# EasyEDA Pro project ProDocument_HMC832_2024-11-26.epro

# Schematic Schematic8

## Sheets
1 P1: Create Date: 2024-09-26; Page Name: P1; Project Name: STI_Project; Schematic Name: Schematic8; Update Date: 2024-09-26; Company: 嘉立创EDA; Page Size: A4; Version: V1.0
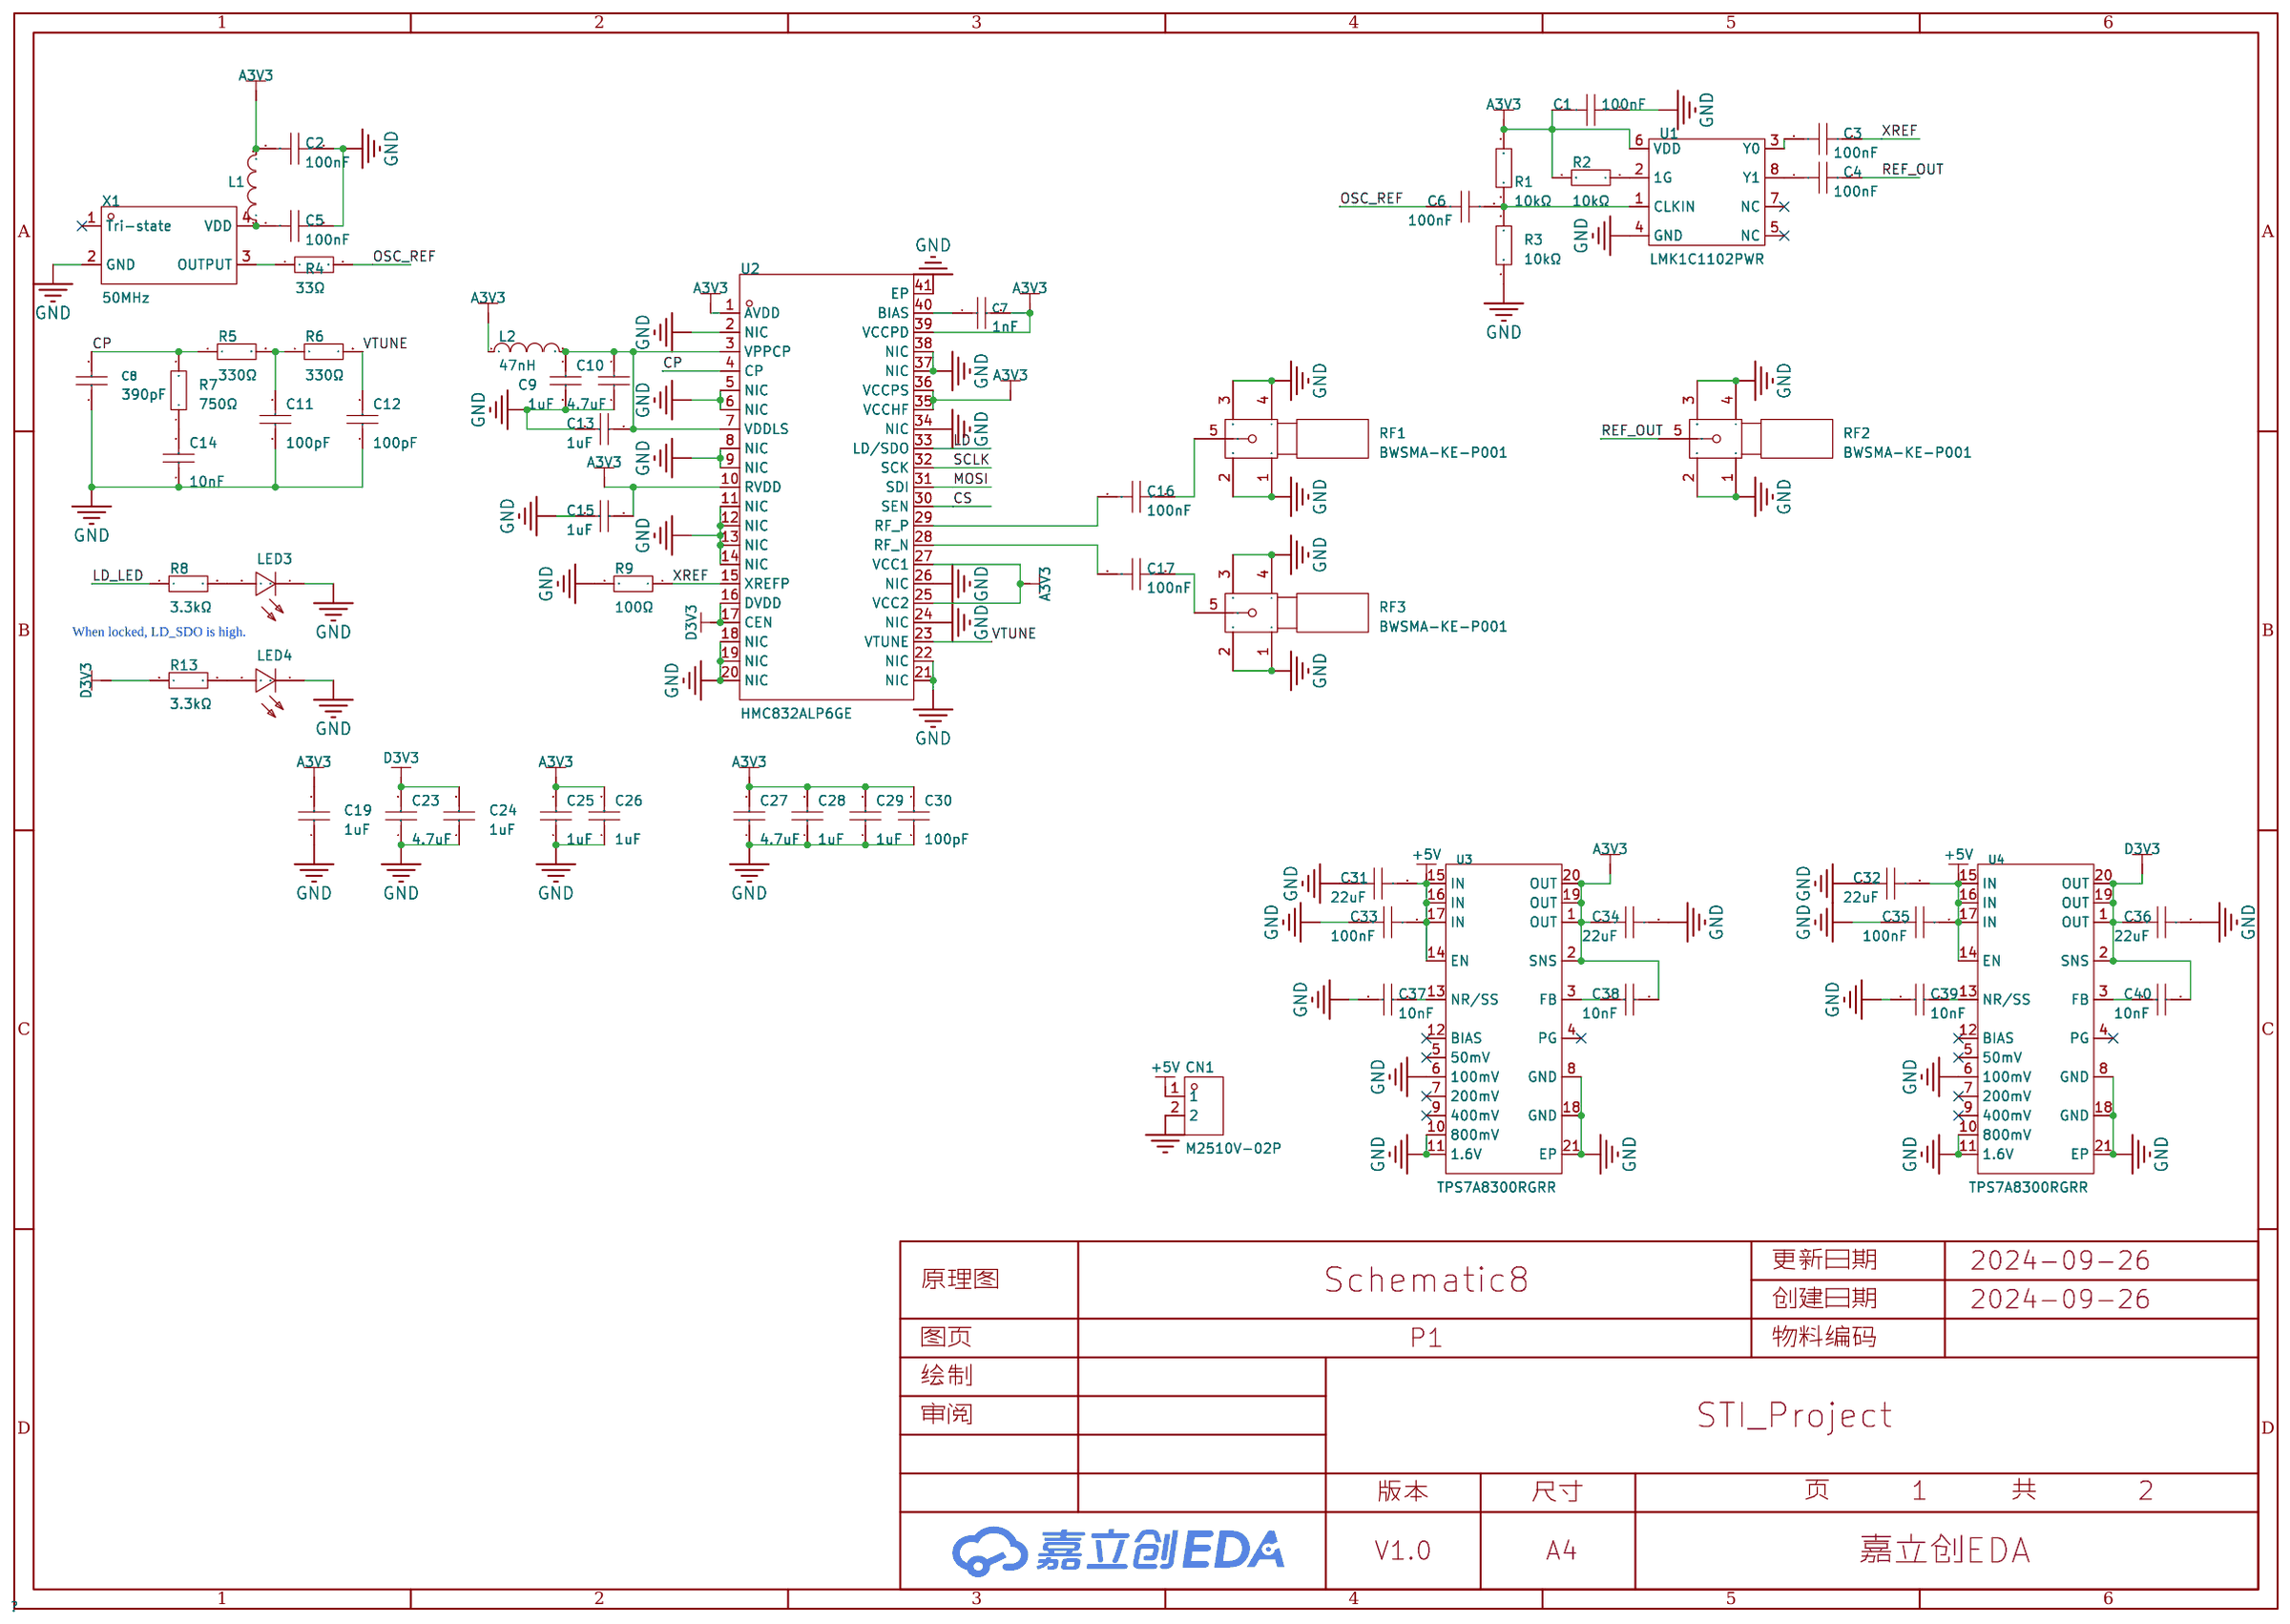
[diagram p0: P1]
2 P2: Page Name: P2
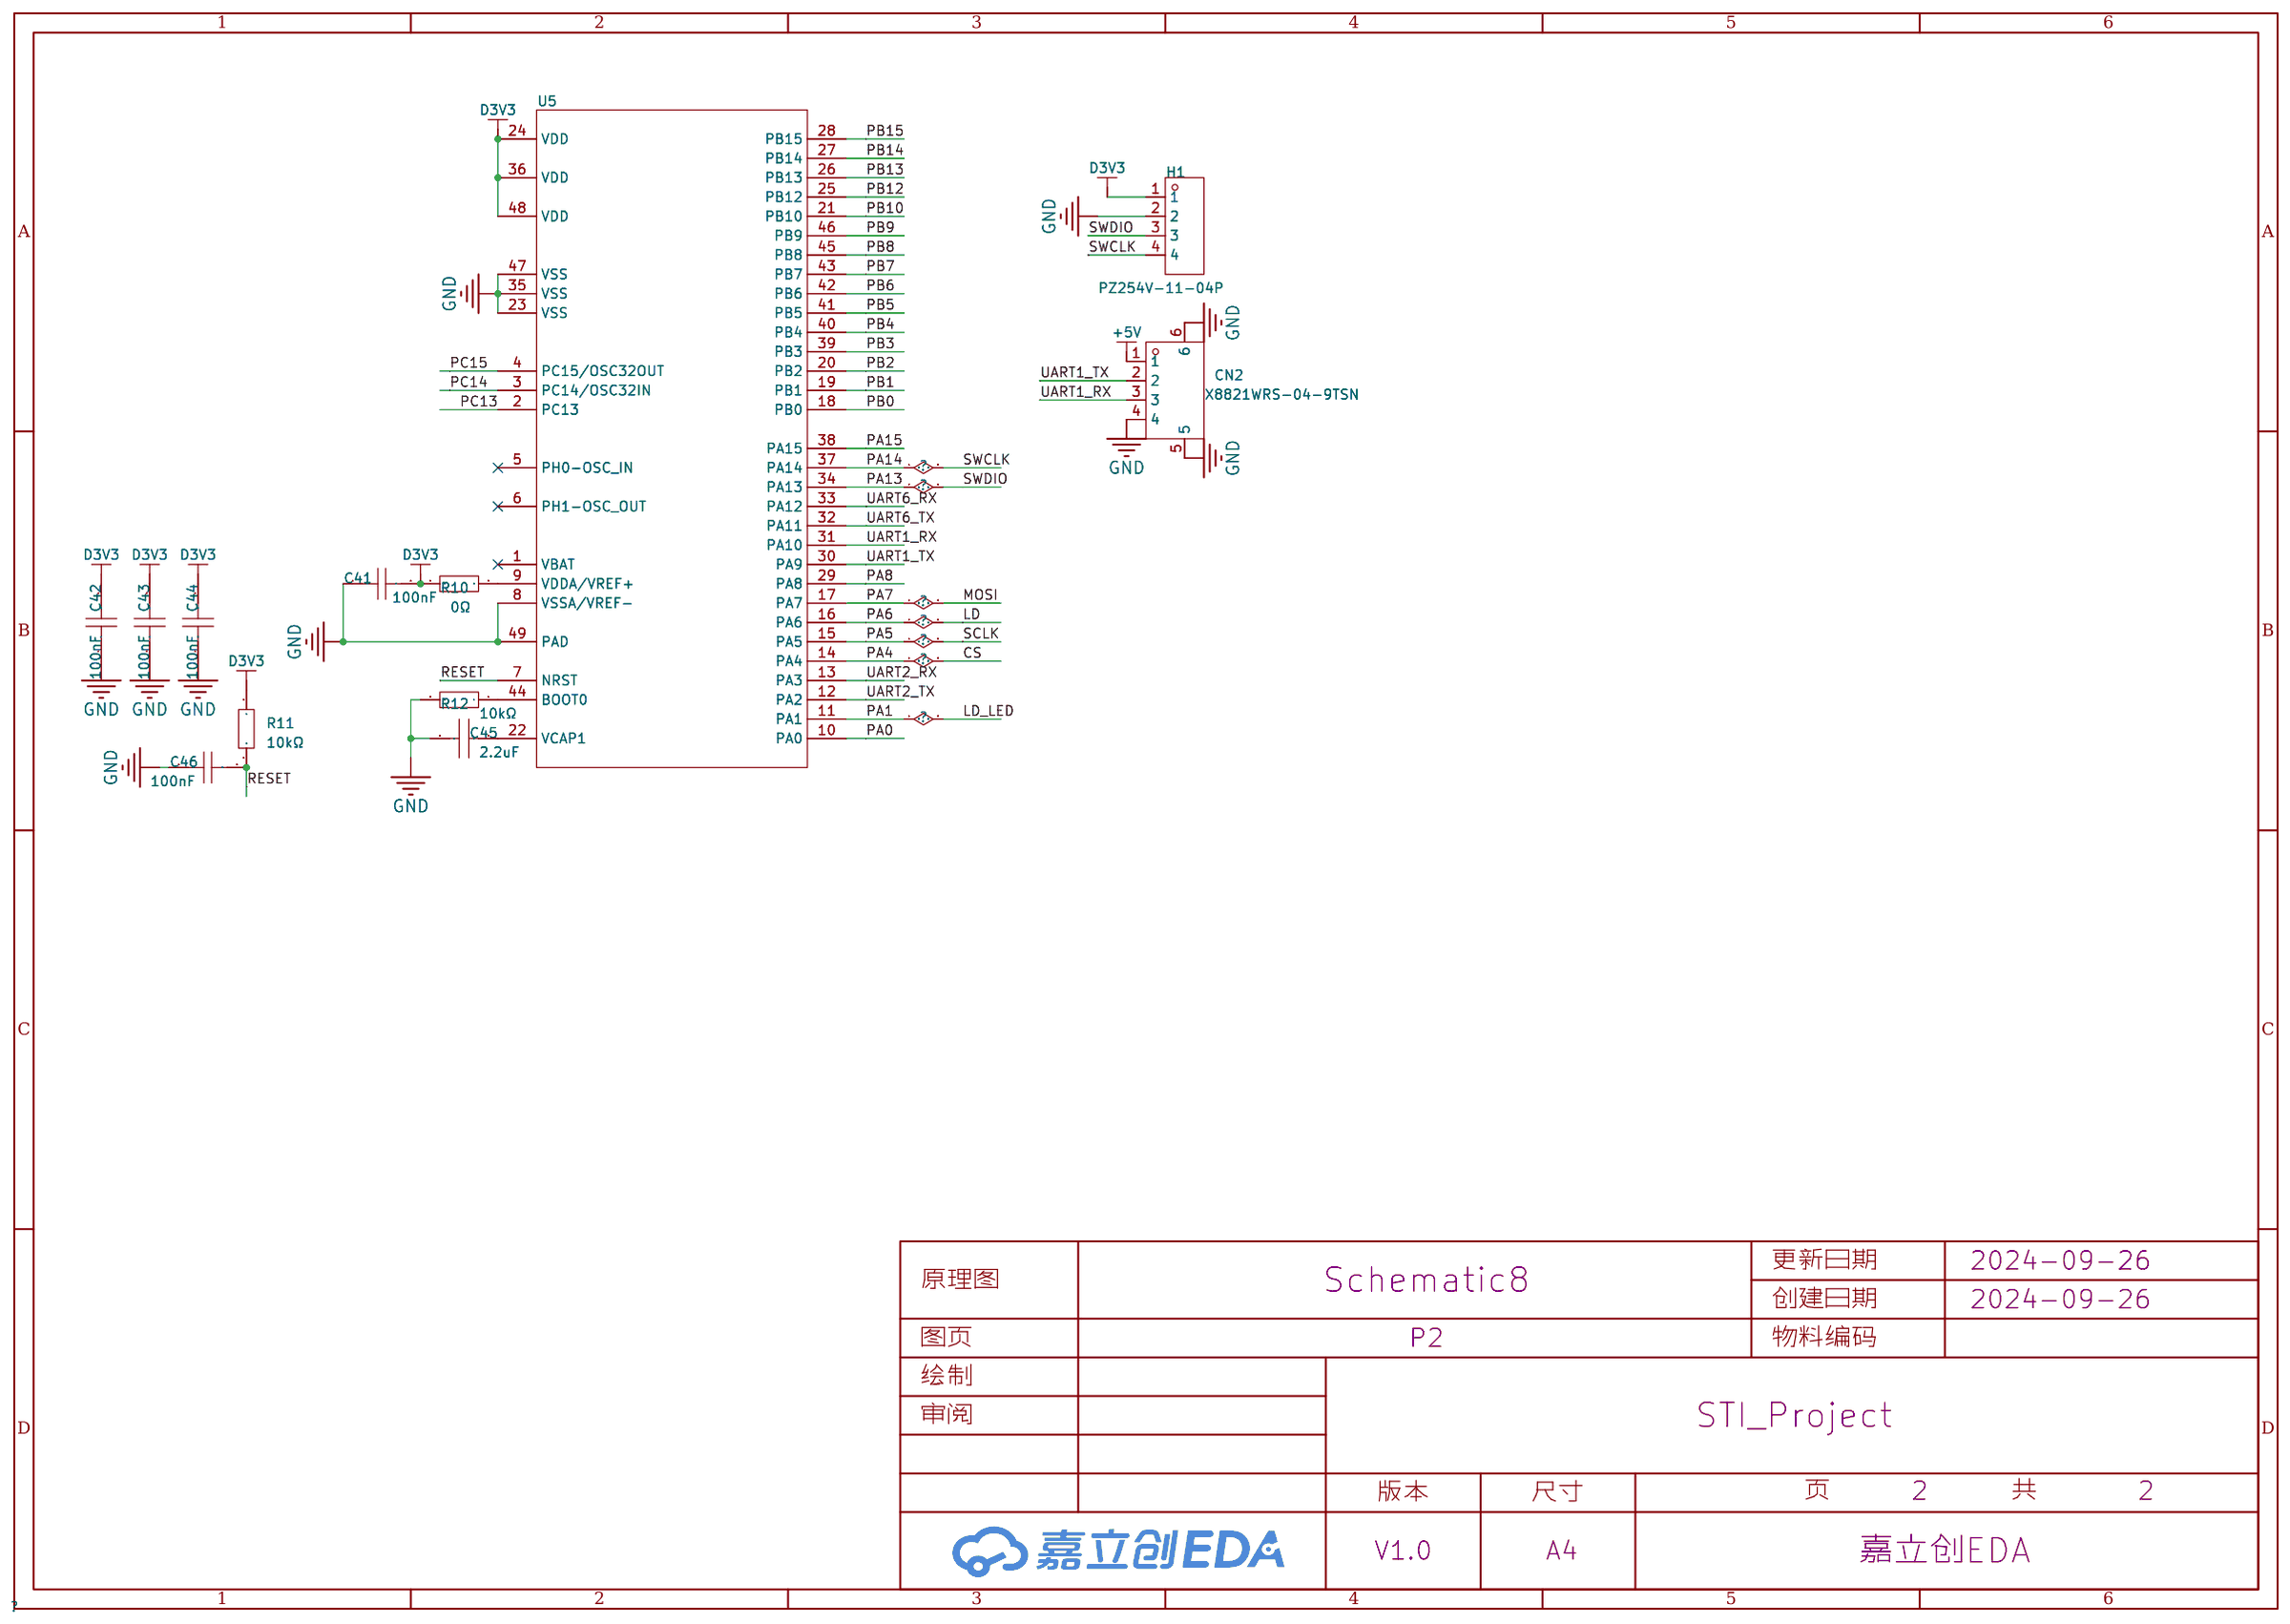
[diagram p1: P2]

## Parts
sheet P1
C1  100nF  [C0402]
C2  100nF  [C0402]
C3  100nF  [C0402]
C4  100nF  [C0402]
C5  100nF  [C0402]
C6  100nF  [C0402]
C7  1nF  [C0402]
C8  390pF  [C0402]
C9  1uF  [C0402]
C10  4.7uF  [C0402]
C11  100pF  [C0402]
C12  100pF  [C0402]
C13  1uF  [C0402]
C14  10nF  [C0402]
C15  1uF  [C0402]
C16  100nF  [C0402]
C17  100nF  [C0402]
C19  1uF  [C0402]
C23  4.7uF  [C0402]
C24  1uF  [C0402]
C25  1uF  [C0402]
C26  1uF  [C0402]
C27  4.7uF  [C0402]
C28  1uF  [C0402]
C29  1uF  [C0402]
C30  100pF  [C0402]
C31  22uF  [C0805]
C32  22uF  [C0805]
C33  100nF  [C0402]
C34  22uF  [C0805]
C35  100nF  [C0402]
C36  22uF  [C0805]
C37  10nF  [C0402]
C38  10nF  [C0402]
C39  10nF  [C0402]
C40  10nF  [C0402]
CN1  M2510V-02P  [CONN-TH_M2510V-02P]
L1  GZ1608D601TF  [L0603]
L2  47nH  [L0603]
LED3  19-213/Y2C-CQ2R2L/3T(CY)  [LED0603-RD-YELLOW]
LED4  19-213/Y2C-CQ2R2L/3T(CY)  [LED0603-RD-YELLOW]
R1  10kΩ  [r0402]
R2  10kΩ  [r0402]
R3  10kΩ  [r0402]
R4  33Ω  [r0402]
R5  330Ω  [r0402]
R6  330Ω  [r0402]
R7  750Ω  [R0402]
R8  3.3kΩ  [r0402]
R9  100Ω  [r0402]
R13  3.3kΩ  [r0402]
RF1  BWSMA-KE-P001  [SMA-SMD_BWSMA-KE-P001]
RF2  BWSMA-KE-P001  [SMA-SMD_BWSMA-KE-P001]
RF3  BWSMA-KE-P001  [SMA-SMD_BWSMA-KE-P001]
U1  LMK1C1102PWR  [TSSOP-8_L4.4-W3.0-P0.65-LS6.4-BL]
U2  HMC832ALP6GE  [LFCSP-40_L6.0-W6.0-P0.50-TL-EP]
U3  TPS7A8300RGRR  [VQFN-20_L3.5-W3.5-P0.50-BL-EP2.0]
U4  TPS7A8300RGRR  [VQFN-20_L3.5-W3.5-P0.50-BL-EP2.0]
X1  50MHz  [OSC-SMD_4P-L3.2-W2.5-BL]
sheet P2
C41  100nF  [C0402]
C42  100nF  [C0402]
C43  100nF  [C0402]
C44  100nF  [C0402]
C45  2.2uF  [C0402]
C46  100nF  [C0402]
CN2  X8821WRS-04-9TSN  [CONN-SMD_X8821WRS-04-9TSN]
H1  PZ254V-11-04P  [HDR-TH_4P-P2.54-V-M]
R10  0Ω  [r0402]
R11  10kΩ  [r0402]
R12  10kΩ  [r0402]
U5  STM32F411CEU6  [UFQFPN-48_L7.0-W7.0-P0.50-BL-EP]

## Library data of the parts
C1-C6 C16 C17 C33 C35 C41-C44 C46 = CL05B104KB54PNC: 容值:100nF;精度:±10%;额定电压:50V;材质(温度系数):X7R;; LCSC Part Name: 100nF ±10% 50V; Supplier Part: C307331; Manufacturer: SAMSUNG(三星); Supplier Footprint: 0402; JLCPCB Part Class: 基础库; Datasheet: https://atta.szlcsc.com/upload/public/pdf/source/20160218/1457707763339.pdf; Supplier: LCSC; Tolerance: ±10%; Voltage Rated: 50V; Temperature Coefficient: X7R
C7 C8 = 0402B102K500NT: 容值:1nF;精度:±10%;额定电压:50V;材质(温度系数):X7R;; LCSC Part Name: 1nF ±10% 50V; Supplier Part: C1523; Manufacturer: FH(风华); Supplier Footprint: 0402; JLCPCB Part Class: 基础库; Datasheet: https://atta.szlcsc.com/upload/public/pdf/source/20200305/C486355_26A10D38EF8C2A5C37091D0039909270.pdf; Supplier: LCSC; Tolerance: ±10%; Voltage Rated: 50V; Temperature Coefficient: X7R
C9 C13 C15 C19 C24 C25 C28 C29 = CL05A105KA5NQNC: 容值:1uF;精度:±10%;额定电压:25V;材质(温度系数):X5R;; LCSC Part Name: 1uF ±10% 25V; Supplier Part: C52923; Manufacturer: SAMSUNG(三星); Supplier Footprint: 0402; JLCPCB Part Class: 基础库; Datasheet: https://atta.szlcsc.com/upload/public/pdf/source/20160218/1457707763339.pdf; Supplier: LCSC; Tolerance: ±10%; Voltage Rated: 25V; Temperature Coefficient: X5R
C10 C23 C27 = CL05A475MP5NRNC: 容值:4.7uF;精度:±20%;额定电压:10V;材质(温度系数):X5R;; LCSC Part Name: 4.7uF ±20% 10V; Supplier Part: C23733; Manufacturer: SAMSUNG(三星); Supplier Footprint: 0402; JLCPCB Part Class: 基础库; Datasheet: https://atta.szlcsc.com/upload/public/pdf/source/20160103/1457707710457.pdf; Supplier: LCSC; Tolerance: ±20%; Voltage Rated: 10V; Temperature Coefficient: X5R
C11 C12 C30 = 0402CG101J500NT: 容值:100pF;精度:±5%;额定电压:50V;材质(温度系数):C0G;; LCSC Part Name: 100pF ±5% 50V; Supplier Part: C1546; Manufacturer: FH(风华); Supplier Footprint: 0402; JLCPCB Part Class: 基础库; Datasheet: https://atta.szlcsc.com/upload/public/pdf/source/20200305/C486355_26A10D38EF8C2A5C37091D0039909270.pdf; Supplier: LCSC; Tolerance: ±5%; Voltage Rated: 50V; Temperature Coefficient: C0G
C14 C37-C40 = CL05B103KB5NNNC: 容值:10nF;精度:±10%;额定电压:50V;材质(温度系数):X7R;; LCSC Part Name: 10nF ±10% 50V; Supplier Part: C15195; Manufacturer: SAMSUNG(三星); Supplier Footprint: 0402; JLCPCB Part Class: 基础库; Datasheet: https://atta.szlcsc.com/upload/public/pdf/source/20160218/1457707763339.pdf; Supplier: LCSC; Tolerance: ±10%; Voltage Rated: 50V; Temperature Coefficient: X7R
C26 = 0402CG101J500NT: 容值:100pF;精度:±5%;额定电压:50V;材质(温度系数):C0G;; LCSC Part Name: 100pF ±5% 50V; Supplier Part: C52923; Manufacturer: FH(风华); Supplier Footprint: 0402; JLCPCB Part Class: 基础库; Datasheet: https://atta.szlcsc.com/upload/public/pdf/source/20200305/C486355_26A10D38EF8C2A5C37091D0039909270.pdf; Supplier: LCSC; Tolerance: ±5%; Voltage Rated: 50V; Temperature Coefficient: C0G
C31 C32 C34 C36 = CL21A226MAQNNNE_C45783: 容值:22uF;精度:±20%;额定电压:25V;材质(温度系数):X5R;; LCSC Part Name: 22uF ±20% 25V; Supplier Part: C45783; Manufacturer: SAMSUNG(三星); Manufacturer Part: CL21A226MAQNNNE; Supplier Footprint: 0805; JLCPCB Part Class: 基础库; Datasheet: https://atta.szlcsc.com/upload/public/pdf/source/20160103/1457707727161.pdf; Supplier: LCSC; Tolerance: ±20%; Voltage Rated: 25V; Temperature Coefficient: X5R
CN1 = M2510V-02P: 参考系列:-;间距:2.54mm;插针结构:1x2P;排数:1;每排PIN数:2;行距:-;公母:公型插针;安装方式:直插;额定电流:3A;工作温度范围:-25℃~+85℃;; LCSC Part Name: 2.54mm 1x2P 直插; Supplier Part: C2764790; Manufacturer: XFCN(兴飞); Supplier Footprint: 直插,P=2.54mm; JLCPCB Part Class: 扩展库; Datasheet: https://atta.szlcsc.com/upload/public/pdf/source/20210810/3DC46818253F58AEF0903D89F89BDDDF.pdf; Supplier: LCSC; Pitch: 2.54mm; Pins Structure: 1x2P; Number of Rows: 1; Number of PINs Per Row: 2; Gender: 公型插针; Mounting Style: 直插; Current Rating (Max): 3A; Operating Temperature Range: -25℃~+85℃
L1 = GZ1608D601TF: 标称阻抗@测试频率:600Ω@100MHz;误差:±25%;直流电阻(RDC):450mΩ;; LCSC Part Name: 单路 0603磁珠 阻抗600Ω@100MHz; Supplier Part: C1002; Manufacturer: Sunlord(顺络); Supplier Footprint: 0603; JLCPCB Part Class: 基础库; Datasheet: https://atta.szlcsc.com/upload/public/pdf/source/20231030/9B6A3E87682CEC1FF6638DFAA81D73FA.pdf; Supplier: LCSC; Impedance @ Frequency: 600Ω@100MHz; Tolerance: ±25%; DC Resistance: 450mΩ; Current Rating: 200mA; Circuits: 1
L2 = L_0603
LED3 LED4 = 19-213/Y2C-CQ2R2L/3T(CY): 发光颜色:黄色;功率:60mW;正向电流:20mA;主波长:585.5nm~591.5nm;二极管配置:-;透镜颜色:无色透明透镜;色温:-;发光角度:120°;载带方式:-;工作温度:-40℃~+85℃;; LCSC Part Name: 黄灯; Supplier Part: C72038; Manufacturer: EVERLIGHT(亿光); Supplier Footprint: 0603; JLCPCB Part Class: 基础库; Datasheet: https://atta.szlcsc.com/upload/public/pdf/source/20160507/1462613613586.pdf; Supplier: LCSC; Emitted Color: 黄色; Power Dissipation: 60mW; Forward Current: 20mA; Dominant Wavelength: 585.5nm~591.5nm; Peak Wavelength: 591nm; Lens Color: 无色透明透镜; Viewing Angle: 120°; Operating Temperature: -40℃~+85℃
R1-R3 R11 R12 = 0402WGF1002TCE: 电阻类型:厚膜电阻;阻值:10kΩ;精度:±1%;功率:62.5mW;最大工作电压:50V;温度系数:±100ppm/℃;; LCSC Part Name: 10kΩ ±1% 62.5mW 厚膜电阻; Supplier Part: C25744; Manufacturer: UNI-ROYAL(厚声); Supplier Footprint: 0402; JLCPCB Part Class: 基础库; Datasheet: https://atta.szlcsc.com/upload/public/pdf/source/20200306/C422600_1E6D84923E4A46A82E41ADD87F860B5C.pdf; Supplier: LCSC; Type: 厚膜电阻; Tolerance: ±1%; Power(Watts): 62.5mW; Overload Voltage (Max): 50V; Temperature Coefficient: ±100ppm/℃; Operating Temperature Range: -55℃~+155℃
R4 = 0402WGF330JTCE: 电阻类型:厚膜电阻;阻值:33Ω;精度:±1%;功率:62.5mW;最大工作电压:50V;温度系数:±100ppm/℃;; LCSC Part Name: 33Ω ±1% 62.5mW 厚膜电阻; Supplier Part: C25105; Manufacturer: UNI-ROYAL(厚声); Supplier Footprint: 0402; JLCPCB Part Class: 基础库; Datasheet: https://atta.szlcsc.com/upload/public/pdf/source/20200306/C422600_1E6D84923E4A46A82E41ADD87F860B5C.pdf; Supplier: LCSC; Type: 厚膜电阻; Tolerance: ±1%; Power(Watts): 62.5mW; Overload Voltage (Max): 50V; Temperature Coefficient: ±100ppm/℃; Operating Temperature Range: -55℃~+155℃
R5 R6 = 0402WGF3300TCE: 电阻类型:厚膜电阻;阻值:330Ω;精度:±1%;功率:62.5mW;最大工作电压:50V;温度系数:±100ppm/℃;; LCSC Part Name: 330Ω ±1% 62.5mW 厚膜电阻; Supplier Part: C25104; Manufacturer: UNI-ROYAL(厚声); Supplier Footprint: 0402; JLCPCB Part Class: 基础库; Datasheet: https://atta.szlcsc.com/upload/public/pdf/source/20200306/C422600_1E6D84923E4A46A82E41ADD87F860B5C.pdf; Supplier: LCSC; Type: 厚膜电阻; Tolerance: ±1%; Power(Watts): 62.5mW; Overload Voltage (Max): 50V; Temperature Coefficient: ±100ppm/℃; Operating Temperature Range: -55℃~+155℃
R7 = 0402WGF1004TCE: 电阻类型:厚膜电阻;阻值:1MΩ;精度:±1%;功率:62.5mW;; LCSC Part Name: 1MΩ ±1% 62.5mW; Supplier Part: C26083; Manufacturer: UNI-ROYAL(厚声); Supplier Footprint: 0402; JLCPCB Part Class: 基础库; Datasheet: https://atta.szlcsc.com/upload/public/pdf/source/20200306/C422600_1E6D84923E4A46A82E41ADD87F860B5C.pdf; Supplier: LCSC; Type: 厚膜电阻; Tolerance: ±1%; Power(Watts): 62.5mW; Temperature Coefficient: ±100ppm/℃; Overload Voltage (Max): 50V; Operating Temperature Range: -55℃~+155℃
R8 R13 = 0402WGF3301TCE: 电阻类型:厚膜电阻;阻值:3.3kΩ;精度:±1%;功率:62.5mW;最大工作电压:50V;温度系数:±100ppm/℃;; LCSC Part Name: 3.3kΩ ±1% 62.5mW 厚膜电阻; Supplier Part: C25890; Manufacturer: UNI-ROYAL(厚声); Supplier Footprint: 0402; JLCPCB Part Class: 基础库; Datasheet: https://atta.szlcsc.com/upload/public/pdf/source/20200306/C422600_1E6D84923E4A46A82E41ADD87F860B5C.pdf; Supplier: LCSC; Type: 厚膜电阻; Tolerance: ±1%; Power(Watts): 62.5mW; Overload Voltage (Max): 50V; Temperature Coefficient: ±100ppm/℃; Operating Temperature Range: -55℃~+155℃
R9 = 0402WGF1000TCE: 电阻类型:厚膜电阻;阻值:100Ω;精度:±1%;功率:62.5mW;最大工作电压:50V;温度系数:±200ppm/℃;; LCSC Part Name: 100Ω ±1% 62.5mW 厚膜电阻; Supplier Part: C25076; Manufacturer: UNI-ROYAL(厚声); Supplier Footprint: 0402; JLCPCB Part Class: 基础库; Datasheet: https://atta.szlcsc.com/upload/public/pdf/source/20200306/C422600_1E6D84923E4A46A82E41ADD87F860B5C.pdf; Supplier: LCSC; Type: 厚膜电阻; Tolerance: ±1%; Power(Watts): 62.5mW; Overload Voltage (Max): 50V; Temperature Coefficient: ±200ppm/℃; Operating Temperature Range: -55℃~+155℃
RF1-RF3 = BWSMA-KE-P001: 连接器类型:板端;接口类型:内孔;端口数量:1;接口直径:5.2mm;接口长度/高度:-;频率-最大值:-;射频系列:SMA;阻抗:50Ω;样式:偏脚;工作温度范围:-;; LCSC Part Name: 内孔 SMA 偏脚; Supplier Part: C496550; Manufacturer: BAT WIRELESS(蝙蝠无线); Supplier Footprint: 插件; JLCPCB Part Class: 扩展库; Datasheet: https://atta.szlcsc.com/upload/public/pdf/source/20240320/28FD502871C976DFF213ABFCF2A0ED51.pdf; Supplier: LCSC; Connector Type: 板端; Interface Type: 内孔; Number of Ports: 1; Interface Diameter: 5.2mm; RF Series: SMA; Impedance: 50Ω; Style: 偏脚
U1 = LMK1C1102PWR: 最大输出频率:250MHz;供电电压:2.375V~2.625V；1.71V~1.89V；3.135V~3.465V;; Supplier Part: C2859546; Manufacturer: TI(德州仪器); Supplier Footprint: TSSOP-8; JLCPCB Part Class: 扩展库; Datasheet: https://www.ti.com/cn/lit/gpn/lmk1c1104; Supplier: LCSC; Output frequency (Max): 250MHz; Supply Voltage: 2.375V~2.625V；1.71V~1.89V；3.135V~3.465V; Operating Temperature: -40℃~+125℃; NAME: VDD; NUMBER: 6; Pin Type: Undefined
U2 = HMC832ALP6GE: Supplier Part: C1535800; Manufacturer: ADI(亚德诺)/LINEAR(凌特); Supplier Footprint: LFCSP-40(6x6); JLCPCB Part Class: 扩展库; Datasheet: https://atta.szlcsc.com/upload/public/pdf/source/20200622/C662764_F858EDCFE9B6964F23C6D5508816660D.pdf; Supplier: LCSC
U3 U4 = TPS7A8300RGRR: 输出类型:-;; Supplier: LCSC; Supplier Part: C544500; Manufacturer: TI(德州仪器); JLCPCB Part Class: 扩展库; Supplier Footprint: VQFN-20-EP(3.5x3.5); Datasheet: https://www.ti.com/cn/lit/gpn/tps7a8300
X1 = OT322550MJBA4SL: 频率:50MHz;频率稳定度:±10ppm;工作电压:1.8V~3.3V;; LCSC Part Name: 50MHz ±10ppm 1.8V~3.3V YSO110TR; Supplier Part: C717684; Manufacturer: YXC(扬兴晶振); Supplier Footprint: SMD3225-4P; JLCPCB Part Class: 扩展库; Datasheet: https://atta.szlcsc.com/upload/public/pdf/source/20210329/C669065_30B18CFE780D377BA4E84F6ED1951959.pdf; Supplier: LCSC; Frequency Stability: ±10ppm; Supply Voltage: 1.8V~3.3V; Operating Temperature: -40℃~+85℃
C45 = CL05A225MQ5NSNC: 容值:2.2uF;精度:±20%;额定电压:6.3V;材质(温度系数):X5R;; LCSC Part Name: 2.2uF ±20% 6.3V; Supplier Part: C12530; Manufacturer: SAMSUNG(三星); Supplier Footprint: 0402; JLCPCB Part Class: 基础库; Datasheet: https://atta.szlcsc.com/upload/public/pdf/source/20160218/1457707763339.pdf; Supplier: LCSC; Tolerance: ±20%; Voltage Rated: 6.3V; Temperature Coefficient: X5R
CN2 = X8821WRS-04-9TSN: 参考系列:XH;间距:2.5mm;插针结构:1x4P;排数:1;每排PIN数:4;行距:-;公母:母型插口;安装方式:卧贴;额定电流:3A;触头材质:黄铜;触头镀层:锡;工作温度范围:-25℃~+85℃;焊接温度(最大值):260℃;; LCSC Part Name: XH 2.5mm 1x4P 卧贴 带耳朵; Supplier Part: C397434; Manufacturer: XKB Connectivity(中国星坤); Supplier Footprint: SMD,P=2.5mm; JLCPCB Part Class: Extended Part; Datasheet: https://atta.szlcsc.com/upload/public/pdf/source/20211009/147B79B22FE81B32D021ABC3AE751292.pdf; Supplier: LCSC; Reference Series: XH; Pitch: 2.5mm; Pins Structure: 1x4P; Number of Rows: 1; Number of PINs Per Row: 4; Gender: 母型插口; Mounting Style: 卧贴; Current Rating (Max): 3A; Contact Material: 黄铜; Contact Plating: 锡; Operating Temperature Range: -25℃~+85℃; Welding Temperature (Max): 260℃
H1 = PZ254V-11-04P: 插针结构:1x4P;间距:2.54mm;行距:-;圆针/方针:方针;安装类型:直插;排数:单排;总PIN位数:4P;额定电流:3A;额定电压:250V;配合针长度:6mm;塑高:2.5mm;端接针长度:3mm;触头材质:-;工作温度范围:-40℃~+105℃;颜色:黑色;; LCSC Part Name: 间距:2.54mm 1x4P 直插 方针; Supplier Part: C2691448; Manufacturer: XFCN(兴飞); Supplier Footprint: 插件,P=2.54mm; JLCPCB Part Class: 扩展库; Datasheet: https://atta.szlcsc.com/upload/public/pdf/source/20200309/C492403_F9F19131791D08044AD4F84F8E751A34.pdf; Supplier: LCSC; Pin Structure: 1x4P; Pitch: 2.54mm; Circluar Pins/Square Pins: 方针; Mounting Type: 直插; Number of Rows: 单排; Number of Pins: 4P; Current Rating (Max): 3A; Voltage Rating (Max): 250V; Length of Mating Pin: 6mm; Insulation Height: 2.5mm; Length of End Connection Pin: 3mm; Operating Temperature Range: -40℃~+105℃; Color: 黑色
R10 = 0402WGF0000TCE: 电阻类型:厚膜电阻;阻值:0Ω;精度:±1%;功率:62.5mW;最大工作电压:50V;温度系数:±800ppm/℃;; LCSC Part Name: 0Ω ±1% 62.5mW 厚膜电阻; Supplier Part: C17168; Manufacturer: UNI-ROYAL(厚声); Supplier Footprint: 0402; JLCPCB Part Class: 基础库; Datasheet: https://atta.szlcsc.com/upload/public/pdf/source/20200306/C422600_1E6D84923E4A46A82E41ADD87F860B5C.pdf; Supplier: LCSC; Type: 厚膜电阻; Tolerance: ±1%; Power(Watts): 62.5mW; Overload Voltage (Max): 50V; Temperature Coefficient: ±800ppm/℃; Operating Temperature Range: -55℃~+155℃
U5 = STM32F411CEU6: 主频（MAX):100MHz;工作电压:1.7V ~ 3.6V;; Supplier Part: C60420; Manufacturer: ST(意法半导体); Supplier Footprint: UFQFPN-48; JLCPCB Part Class: Extended Part; Datasheet: https://atta.szlcsc.com/upload/public/pdf/source/20151026/1457707507170.pdf; Supplier: LCSC; Speed: 100MHz; Voltage - Supply (Vcc/Vdd): 1.7V ~ 3.6V; Program Memory Size: 512KB; RAM Size: 128KB; Number of I/O: 36; A/D: 10x12bit; PWM: 32; UART/USART: 3 USART; SPI: 5; I2C（SMBUS/PMBUS）: 3; USB Device: 1; USB Host/OTG: 1

## Nets
+5V: C31.2 C32.2 C33.2 C35.2 CN1.1 CN2.1 U3.14(EN) U3.15(IN) U3.16(IN) U3.17(IN) U4.14(EN) U4.15(IN) U4.16(IN) U4.17(IN)
A3V3: C1.1 C2.1 C7.2 C15.1 C19.2 C25.2 C26.2 C27.2 C28.2 C29.2 C30.2 C34.1 C38.2 L1.2 L2.1 R1.2 R2.2 U1.6(VDD) U2.1(AVDD) U2.10(RVDD) U2.25(VCC2) U2.27(VCC1) U2.35(VCCHF) U2.36(VCCPS) U2.39(VCCPD) U3.1(OUT) U3.2(SNS) U3.19(OUT) U3.20(OUT)
D3V3: C23.2 C24.2 C36.1 C40.2 C41.2 C42.2 C43.2 C44.2 H1.1 R10.1 R11.2 R13.1 U2.16(DVDD) U2.17(CEN) U4.1(OUT) U4.2(SNS) U4.19(OUT) U4.20(OUT) U5.24(VDD) U5.36(VDD) U5.48(VDD)
GND: C1.2 C2.2 C5.2 C8.1 C9.2 C10.1 C11.1 C12.1 C13.2 C14.1 C15.2 C19.1 C23.1 C24.1 C25.1 C26.1 C27.1 C28.1 C29.1 C30.1 C31.1 C32.1 C33.1 C34.2 C35.1 C36.2 C37.1 C39.1 C41.1 C42.1 C43.1 C44.1 C45.1 C46.1 CN1.2 CN2.4 CN2.5 CN2.6 H1.2 LED3.1(C) LED4.1(C) R3.1 R9.2 R12.2 RF1.1 RF1.2 RF1.3 RF1.4 RF2.1 RF2.2 RF2.3 RF2.4 RF3.1 RF3.2 RF3.3 RF3.4 U1.4(GND) U2.2(NIC) U2.5(NIC) U2.6(NIC) U2.8(NIC) U2.9(NIC) U2.11(NIC) U2.12(NIC) U2.13(NIC) U2.14(NIC) U2.18(NIC) U2.19(NIC) U2.20(NIC) U2.21(NIC) U2.22(NIC) U2.24(NIC) U2.26(NIC) U2.34(NIC) U2.37(NIC) U2.38(NIC) U2.41(EP) U3.6(100mV) U3.8(GND) U3.10(800mV) U3.11(1.6V) U3.18(GND) U3.21(EP) U4.6(100mV) U4.8(GND) U4.10(800mV) U4.11(1.6V) U4.18(GND) U4.21(EP) U5.8(VSSA/VREF-) U5.23(VSS) U5.35(VSS) U5.47(VSS) U5.49(PAD) X1.2(GND)
CP: C8.2 R5.1 R7.2 U2.4(CP)
CS: U2.30(SEN) U5.14(PA4)
LD: U2.33(LD/SDO) U5.16(PA6)
LD_LED: R8.1 U5.11(PA1)
MOSI: U2.31(SDI) U5.17(PA7)
OSC_REF: C6.1 R4.2
PA0: U5.10(PA0)
PA5: U2.32(SCK) U5.15(PA5)
PA8: U5.29(PA8)
PA13: H1.3 U5.34(PA13)
PA14: H1.4 U5.37(PA14)
PA15: U5.38(PA15)
PB0: U5.18(PB0)
PB1: U5.19(PB1)
PB2: U5.20(PB2)
PB3: U5.39(PB3)
PB4: U5.40(PB4)
PB5: U5.41(PB5)
PB6: U5.42(PB6)
PB7: U5.43(PB7)
PB8: U5.45(PB8)
PB9: U5.46(PB9)
PB10: U5.21(PB10)
PB12: U5.25(PB12)
PB13: U5.26(PB13)
PB14: U5.27(PB14)
PB15: U5.28(PB15)
PC13: U5.2(PC13)
PC14: U5.3(PC14/OSC32IN)
PC15: U5.4(PC15/OSC32OUT)
REF_OUT: C4.2 RF2.5
RESET: C46.2 R11.1 U5.7(NRST)
UART1_RX: CN2.3 U5.31(PA10)
UART1_TX: CN2.2 U5.30(PA9)
UART2_RX: U5.13(PA3)
UART2_TX: U5.12(PA2)
UART6_RX: U5.33(PA12)
UART6_TX: U5.32(PA11)
VTUNE: C12.2 R6.2 U2.23(VTUNE)
XREF: C3.2 R9.1 U2.15(XREFP)
$1N3433: C9.1 C10.2 C13.1 L2.2 U2.3(VPPCP) U2.7(VDDLS)
$1N3441: C7.1 U2.40(BIAS)
$1N3488: C16.1 U2.29(RF_P)
$1N3500: C11.2 R5.2 R6.1
$1N3537: C5.1 L1.1 X1.4(VDD)
$1N4067: R4.1 X1.3(OUTPUT)
$1N4471: C17.1 U2.28(RF_N)
$1N6949: C16.2 RF1.5
$1N7035: C17.2 RF3.5
$1N7533: C37.2 U3.13(NR/SS)
$1N7535: C38.1 U3.3(FB)
$1N8207: C39.2 U4.13(NR/SS)
$1N8209: C40.1 U4.3(FB)
$1N9138: C6.2 R1.1 R3.2 U1.1(CLKIN)
$1N10941: C14.2 R7.1
$1N14740: R2.1 U1.2(1G)
$1N14817: C4.1 U1.8(Y1)
$1N14821: C3.1 U1.3(Y0)
$1N15105: LED3.2(A) R8.2
$1N15107: LED4.2(A) R13.2
$2N1343: C45.2 U5.22(VCAP1)
$2N1390: R12.1 U5.44(BOOT0)
$2N1698: R10.2 U5.9(VDDA/VREF+)

Not connected (* = marked no-connect by the designer): U1 5(NC)* 7(NC)*; U3 4(PG)* 5(50mV)* 7(200mV)* 9(400mV)* 12(BIAS)*; U4 4(PG)* 5(50mV)* 7(200mV)* 9(400mV)* 12(BIAS)*; U5 1(VBAT)* 5(PH0-OSC_IN)* 6(PH1-OSC_OUT)*; X1 1(Tri-state)*

## Notes on the sheets
sheet 1
- When locked, LD_SDO is high.

# Board PCB12
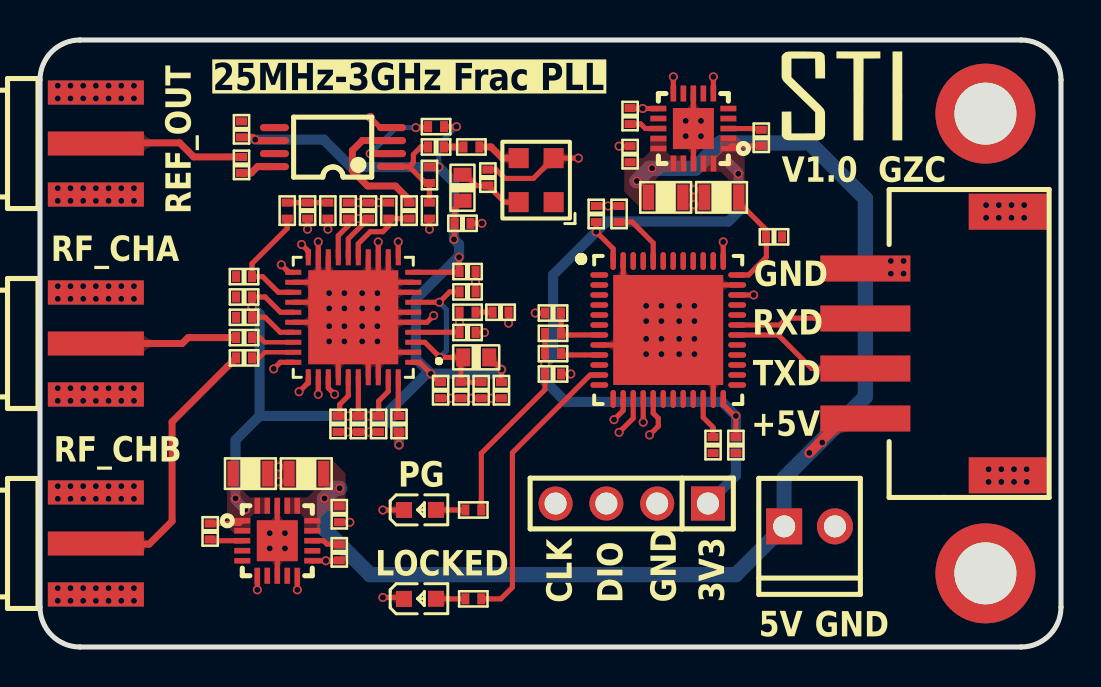
[diagram p2: board, top side]
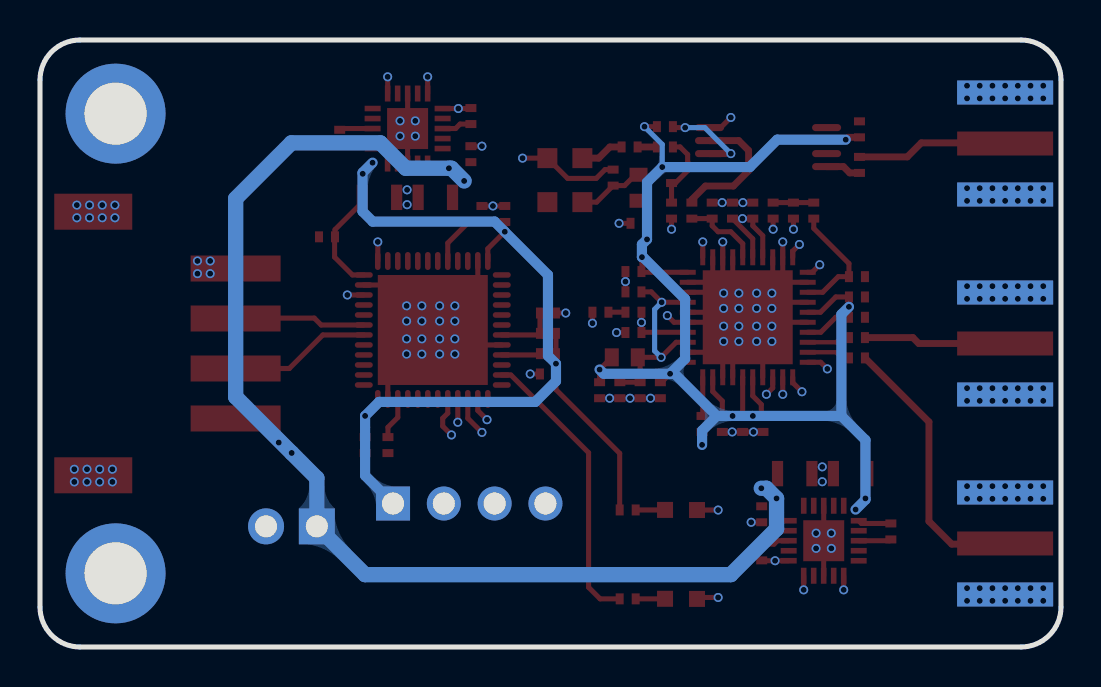
[diagram p3: board, bottom side, seen from below]

Outline 51.05 x 30.35 mm; copper layers: Top Layer, Inner1, Inner2, Bottom Layer. Coordinates in mm from the lower left corner of the outline.
Outline path: 0,28.35 0,2 arc(0.59,0.59) 2,0 49.05,0 arc(50.47,0.59) 51.05,2 51.05,28.35 arc(50.47,29.77) 49.05,30.35 2,30.35 arc(0.59,29.77) 0,28.35
Stack: Top Layer 0.035mm 外层铜厚1oz / Dielectric1 0.2104mm 7628 RC49% 8.6mil / Inner1 0.0152mm 内层铜厚 / Dielectric2 1.065mm 1.1mm H/HOZ 含铜 / Inner2 0.0152mm 内层铜厚 / Dielectric3 0.2104mm 7628 RC49% 8.6mil / Bottom Layer 0.035mm 外层铜厚1oz

## Design rules (mm)
net $1N3488: DP1
net $1N4471: DP1
template: 自定义配置
spacing copperThickness1oz (default): track to track 0.102, other pairs 0.152 to 0.3
spacing copperThickness2oz: track to track 0.203, other pairs 0.152 to 0.3
track width copperThickness1oz (default): min 0.127, default 0.254, max 2.54
track width copperThickness2oz: min 0.203, default 0.254, max 2.54
differential pair differentialPair (default): width min 0.127, default 0.221, max 2.54; gap min 0.203, default 0.203
via viaSize (default): diameter min 0.45, default 0.45, max 10; hole min 0.3, default 0.3, max 6.299

## Placement (name value [footprint] x y rotation side)
C1  100nF  [C0402]  10.08 25.89 90 top
C2  100nF  [C0402]  21.13 21.19 0 top
C3  100nF  [C0402]  18.46 21.82 270 top
C4  100nF  [C0402]  10.08 24.11 90 top
C5  100nF  [C0402]  22.4 23.47 90 top
C6  100nF  [C0402]  19.81 25 180 top
C7  1nF  [C0402]  17.95 11.15 270 top
C8  390pF  [C0402]  21.38 15.73 180 top
C9  1uF  [C0402]  21.05 12.84 270 top
C10  4.7uF  [C0402]  22.06 12.84 90 top
C11  100pF  [C0402]  13.38 21.82 90 top
C12  100pF  [C0402]  10.2 18.52 0 top
C13  1uF  [C0402]  21.38 17.76 0 top
C14  10nF  [C0402]  23.03 16.74 180 top
C15  1uF  [C0402]  21.38 18.77 0 top
C16  100nF  [C0402]  10.2 14.46 180 top
C17  100nF  [C0402]  10.2 15.47 180 top
C19  1uF  [C0402]  23.07 12.84 90 top
C23  4.7uF  [C0402]  15.41 21.82 270 top
C24  1uF  [C0402]  16.43 21.82 270 top
C25  1uF  [C0402]  10.2 16.49 0 top
C26  1uF  [C0402]  10.2 17.5 0 top
C27  4.7uF  [C0402]  20.03 12.84 90 top
C28  1uF  [C0402]  14.9 11.15 90 top
C29  1uF  [C0402]  16.93 11.15 90 top
C30  100pF  [C0402]  15.92 11.15 90 top
C31  22uF  [C0805]  13.31 8.67 0 top
C32  22uF  [C0805]  31.29 22.48 180 top
C33  100nF  [C0402]  14.97 6.64 90 top
C34  22uF  [C0805]  10.52 8.67 0 top
C35  100nF  [C0402]  29.51 24.64 270 top
C36  22uF  [C0805]  34.08 22.48 180 top
C37  10nF  [C0402]  14.97 4.73 90 top
C38  10nF  [C0402]  8.51 5.78 90 top
C39  10nF  [C0402]  29.51 26.55 270 top
C40  10nF  [C0402]  36.07 25.46 270 top
C41  100nF  [C0402]  25.65 13.65 180 top
C42  100nF  [C0402]  36.7 20.51 180 top
C43  100nF  [C0402]  34.8 10.1 90 top
C44  100nF  [C0402]  27.81 21.65 270 top
C45  2.2uF  [C0402]  33.65 10.1 90 top
C46  100nF  [C0402]  25.65 16.7 0 top
CN1  M2510V-02P  [CONN-TH_M2510V-02P]  38.48 6.03 180 top
CN2  X8821WRS-04-9TSN  [CONN-SMD_X8821WRS-04-9TSN]  44.83 15.18 90 top
H1  PZ254V-11-04P  [HDR-TH_4P-P2.54-V-M]  29.59 7.18 180 top
L1  GZ1608D601TF  [L0603]  21.13 22.96 270 top
L2  47nH  [L0603]  21.81 14.48 180 top
LED3  19-213/Y2C-CQ2R2L/3T(CY)  [LED0603-RD-YELLOW]  19 2.41 0 top
LED4  19-213/Y2C-CQ2R2L/3T(CY)  [LED0603-RD-YELLOW]  19 6.85 0 top
NOREF  -  [Pad_e99]  47.27 3.68 0 top
NOREF#2  -  [Pad_e98]  47.28 26.67 0 top
R1  10kΩ  [r0402]  19.47 23.6 90 top
R2  10kΩ  [r0402]  19.81 26.02 0 top
R3  10kΩ  [r0402]  19.47 21.82 90 top
R4  33Ω  [r0402]  21.57 25 180 top
R5  330Ω  [r0402]  14.39 21.82 90 top
R6  330Ω  [r0402]  12.36 21.82 270 top
R7  750Ω  [R0402]  21.38 16.74 180 top
R8  3.3kΩ  [r0402]  21.67 2.41 180 top
R9  100Ω  [r0402]  17.44 21.82 90 top
R10  0Ω  [r0402]  25.65 14.67 0 top
R11  10kΩ  [r0402]  25.65 15.68 180 top
R12  10kΩ  [r0402]  28.96 21.65 90 top
R13  3.3kΩ  [r0402]  21.67 6.85 180 top
RF1  BWSMA-KE-P001  [SMA-SMD_BWSMA-KE-P001]  2.79 5.18 180 top
RF2  BWSMA-KE-P001  [SMA-SMD_BWSMA-KE-P001]  2.79 25.18 180 top
RF3  BWSMA-KE-P001  [SMA-SMD_BWSMA-KE-P001]  2.79 15.18 180 top
U1  LMK1C1102PWR  [TSSOP-8_L4.4-W3.0-P0.65-LS6.4-BL]  14.65 25 90 top
U2  HMC832ALP6GE  [LFCSP-40_L6.0-W6.0-P0.50-TL-EP]  15.66 16.49 180 top
U3  TPS7A8300RGRR  [VQFN-20_L3.5-W3.5-P0.50-BL-EP2.0]  11.87 5.31 270 top
U4  TPS7A8300RGRR  [VQFN-20_L3.5-W3.5-P0.50-BL-EP2.0]  32.67 25.93 90 top
U5  STM32F411CEU6  [UFQFPN-48_L7.0-W7.0-P0.50-BL-EP]  31.41 15.85 270 top
X1  50MHz  [OSC-SMD_4P-L3.2-W2.5-BL]  24.81 23.35 90 top

## Footprints (pads in the part's own frame, mm; a bottom-side part is the same pattern mirrored in y, then rotated)
C0402
  rect 0.4x0.55 smd: 1(-0.4,0) 2(0.4,0)
C0805
  rect 0.559x1.27 smd: 1(-0.86,0) 2(0.86,0)
CONN-SMD_X8821WRS-04-9TSN
  rect 1.3x4.5 smd: 1(-3.75,3.56) 2(-1.25,3.56) 3(1.25,3.56) 4(3.75,3.56)
  rect 1.8x3.9 smd: 5(6.59,-3.56) 6(-6.59,-3.56)
CONN-TH_M2510V-02P
  rect 1.8x1.8 hole 1.1: 1(1.27,0)
  round 1.8 hole 1.1: 2(-1.27,0)
HDR-TH_4P-P2.54-V-M
  rect 1.7x1.7 hole 1.1: 1(-3.81,0)
  round 1.7 hole 1.1: 2(-1.27,0) 3(1.27,0) 4(3.81,0)
L0603
  rect 0.7x0.9 smd: 1(-0.65,0) 2(0.65,0)
LED0603-RD-YELLOW
  rect 0.8x0.8 smd: 1(-0.799,-0.004) 2(0.799,0.004)
LFCSP-40_L6.0-W6.0-P0.50-TL-EP
  rect 0.8x0.25 smd: 1(-3,2.25) 2(-3,1.75) 3(-3,1.25) 4(-3,0.75) 5(-3,0.25) 6(-3,-0.25) 7(-3,-0.75) 8(-3,-1.25) 9(-3,-1.75) 10(-3,-2.25) 21(3,-2.25) 22(3,-1.75) 23(3,-1.25) 24(3,-0.75) 25(3,-0.25) 26(3,0.25) 27(3,0.75) 28(3,1.25) 29(3,1.75) 30(3,2.25)
  rect 0.25x0.8 smd: 11(-2.25,-3) 12(-1.75,-3) 13(-1.25,-3) 14(-0.75,-3) 15(-0.25,-3) 16(0.25,-3) 17(0.75,-3) 18(1.25,-3) 19(1.75,-3) 20(2.25,-3) 31(2.25,3) 32(1.75,3) 33(1.25,3) 34(0.75,3) 35(0.25,3) 36(-0.25,3) 37(-0.75,3) 38(-1.25,3) 39(-1.75,3) 40(-2.25,3)
  rect 4.5x4.7 smd: 41(0,0)
OSC-SMD_4P-L3.2-W2.5-BL
  rect 1x1 smd: 1(-1.1,-0.875) 2(1.1,-0.875) 3(1.1,0.875) 4(-1.1,0.875)
Pad_e98
  round 5 hole 3.1: 50(0,0)
Pad_e99
  round 5 hole 3.1: 50(0,0)
R0402
  rect 0.4x0.55 smd: 1(-0.4,0) 2(0.4,0)
r0402
  rect 0.4x0.55 smd: 1(-0.4,0) 2(0.4,0)
SMA-SMD_BWSMA-KE-P001
  rect 4.8x1.2 smd: 1(0,-2.55) 2(0,2.55) 5(0,0)
  rect 4.8x1.2 smd far side: 3(0,2.55) 4(0,-2.55)
TSSOP-8_L4.4-W3.0-P0.65-LS6.4-BL
  oval 0.353x1.454 smd: 1(-0.975,-2.927) 2(-0.325,-2.927) 3(0.325,-2.927) 4(0.975,-2.927) 5(0.975,2.927) 6(0.325,2.927) 7(-0.325,2.927) 8(-0.975,2.927)
UFQFPN-48_L7.0-W7.0-P0.50-BL-EP
  oval 0.28x0.899 smd: 1(-2.751,-3.45) 2(-2.251,-3.45) 3(-1.75,-3.45) 4(-1.25,-3.45) 5(-0.75,-3.45) 6(-0.249,-3.45) 7(0.249,-3.45) 8(0.75,-3.45) 9(1.25,-3.45) 10(1.75,-3.45) 11(2.251,-3.45) 12(2.751,-3.45) 25(2.751,3.45) 26(2.251,3.45) 27(1.75,3.45) 28(1.25,3.45) 29(0.75,3.45) 30(0.249,3.45) 31(-0.249,3.45) 32(-0.75,3.45) 33(-1.25,3.45) 34(-1.75,3.45) 35(-2.251,3.45) 36(-2.751,3.45)
  oval 0.899x0.28 smd: 13(3.45,-2.751) 14(3.45,-2.251) 15(3.45,-1.75) 16(3.45,-1.25) 17(3.45,-0.75) 18(3.45,-0.249) 19(3.45,0.249) 20(3.45,0.75) 21(3.45,1.25) 22(3.45,1.75) 23(3.45,2.251) 24(3.45,2.751) 37(-3.45,2.751) 38(-3.45,2.251) 39(-3.45,1.75) 40(-3.45,1.25) 41(-3.45,0.75) 42(-3.45,0.249) 43(-3.45,-0.249) 44(-3.45,-0.75) 45(-3.45,-1.25) 46(-3.45,-1.75) 47(-3.45,-2.251) 48(-3.45,-2.751)
  rect 5.499x5.499 smd: 49(0,0)
VQFN-20_L3.5-W3.5-P0.50-BL-EP2.0
  rect 0.28x0.8 smd: 1(-1.001,-1.751) 2(-0.501,-1.751) 3(-0.001,-1.751) 4(0.499,-1.751) 5(1,-1.749) 11(0.999,1.749) 12(0.501,1.751) 13(-0.001,1.749) 14(-0.501,1.749) 15(-1.001,1.749)
  rect 0.8x0.28 smd: 6(1.75,-0.999) 7(1.75,-0.499) 8(1.75,0.001) 9(1.75,0.501) 10(1.75,1.001) 16(-1.75,0.999) 17(-1.75,0.499) 18(-1.75,-0.001) 19(-1.75,-0.501) 20(-1.75,-1.001)
  rect 2.05x2.05 smd: 21(-0.001,-0.001)

## Nets
As in the schematic, except:
GND: C1.2 C2.2 C5.2 C8.1 C9.2 C10.1 C11.1 C12.1 C13.2 C14.1 C15.2 C19.1 C23.1 C24.1 C25.1 C26.1 C27.1 C28.1 C29.1 C30.1 C31.1 C32.1 C33.1 C34.2 C35.1 C36.2 C37.1 C39.1 C41.1 C42.1 C43.1 C44.1 C45.1 C46.1 CN1.2 CN2.4 CN2.5 CN2.6 H1.2 LED3.1 LED4.1 NOREF.50 NOREF#2.50 R3.1 R9.2 R12.2 RF1.1 RF1.2 RF1.3 RF1.4 RF2.1 RF2.2 RF2.3 RF2.4 RF3.1 RF3.2 RF3.3 RF3.4 U1.4 U2.2 U2.5 U2.6 U2.8 U2.9 U2.11 U2.12 U2.13 U2.14 U2.18 U2.19 U2.20 U2.21 U2.22 U2.24 U2.26 U2.34 U2.37 U2.38 U2.41 U3.6 U3.8 U3.10 U3.11 U3.18 U3.21 U4.6 U4.8 U4.10 U4.11 U4.18 U4.21 U5.8 U5.23 U5.35 U5.47 U5.49 X1.2

Pads without a net: U1 5 7; U3 4 5 7 9 12; U4 4 5 7 9 12; U5 1 5 6; X1 1

## Via types
v1: diameter 0.45, hole 0.3, Top Layer to Bottom Layer, 223 vias

## Routing (per net, layer and track width the routed paths; a pad name or vN(x,y) marks a point on that pad's centre or on a via; arc(x,y) is an arc through that point)
+5V: length 62.4
  Top Layer w0.508: CN2.1 40.19,11.43 v1(38.47,9.7)
  Bottom Layer w0.762: v1(29.84,23.3) 30.48,23.94 v1(30.61,23.94) 32.77,23.94 34.04,25.21 38.48,25.21 41.27,22.42 41.27,12.51 v1(38.47,9.7) 37.21,8.45 CN1.1 34.8,3.62 16.51,3.62 14.22,5.91 v1(14.22,7.43) 14.73,7.94 v1(14.99,7.94)
  vias: v1(39.12,10.22)
A3V3: length 77.5
  Top Layer w0.254: U2.1 18.97,14.24 v1(19.55,13.66) 19.97,13.24 20.03,13.24 ; U2.39 17.41,12.78 16.93,12.3 16.93,11.55 v1(16.42,11.55) 15.92,11.55 ; 15.92,11.55 15.92,13.48 15.91,13.49 ; 15.92,11.55 v1(15.41,11.55) 15.07,11.55 14.99,11.64 ; C19.2 v1(23.07,13.87) 22.46,14.48 ; U2.35 15.41,12.56 14.99,12.13 14.99,11.64 ; 14.99,11.64 14.9,11.55 ; 17.95,10.75 17.95,10.75 v1(17.95,10.11) ; 20.95,18.75 20.94,18.74 U2.10 ; 20.95,18.75 v1(20.95,19.49) ; 20.95,18.75 C15.1 ; U2.25 12.03,16.74 11.26,17.5 C26.2 v1(10.6,17.01) C25.2 11.26,16.49 12.01,15.74 U2.27 ; U3.1 9.98,6.18 C38.2 ; R2.2 v1(20.83,26.02) ; L1.2 20.73,21.91 C2.1 20.73,20.41 v1(20.7,20.38)
  Top Layer w0.345: R1.2 v1(19.94,24) ; C1.1 10.65,25.49 10.81,25.32 U1.6
  Bottom Layer w0.254: v1(19.94,24) 19.94,25.13 v1(20.83,26.02)
  Bottom Layer w0.508: v1(10.27,6.87) 9.78,7.37 v1(9.78,7.43) 9.78,10.35 10.98,11.55 ; v1(17.95,10.11) 17.95,10.82 17.21,11.55 ; 17.21,11.55 v1(16.42,11.55) v1(15.41,11.55) 10.98,11.55 ; 17.21,11.55 19.32,13.66 v1(19.55,13.66) ; 10.98,11.55 10.98,16.63 v1(10.6,17.01) ; v1(19.55,13.66) 18.8,14.41 18.8,17.4 20.89,19.49 v1(20.95,19.49) 20.95,20.13 v1(20.7,20.38) 20.7,23.24 v1(19.94,24) 15.56,24 14.19,25.37 v1(10.76,25.37) ; v1(19.55,13.66) 22.86,13.66 v1(23.07,13.87)
D3V3: length 73.8
  Top Layer w0.254: U2.16 15.41,20.41 16.43,21.42 v1(15.93,21.42) 15.41,21.42 15.41,21.06 14.91,20.57 14.91,19.49 ; C36.1 34.94,22.23 36.3,20.87 C42.2 36.32,20.49 36.32,19.49 35.43,18.6 U5.36 ; R11.2 R10.1 v1(25.25,14.17) C41.2 25.25,12.87 22.07,9.69 R13.1 ; C40.2 34.56,25.06 34.42,24.93 ; U5.48 28.66,19.92 v1(27.81,20.76) C44.2 ; C43.2 34.8,11.49 34.16,12.13 U5.24
  Inner2 w0.508: v1(27.81,20.76) 23.62,20.76 22.35,22.03 18.42,22.03 17.8,21.42 v1(15.93,21.42)
  Bottom Layer w0.508: v1(34.42,24.22) 34.92,23.72 34.92,21.78 34.42,21.27 28.32,21.27 v1(27.81,20.76) 25.65,18.61 25.65,14.57 v1(25.25,14.17) 25.25,13.29 26.29,12.26 34.1,12.26 v1(34.8,11.56) 34.8,8.57 H1.1
  vias: v1(34.92,23.66)
GND: length 96.8
  Top Layer w0.254: U2.9 17.41,18.24 ; 17.41,18.24 16.91,17.74 ; 17.41,18.24 U2.12 ; C23.1 v1(15.91,22.22) C24.1 v1(16.95,22.22) R9.2 ; C5.2 22.8,23.87 23.24,23.43 24.67,23.43 X1.2 v1(26.92,24.45) ; v1(13.91,20.26) 13.91,18.24 ; C11.1 v1(13.38,20.89) ; C19.1 v1(22.57,12.44) C10.1 v1(21.55,12.44) C9.2 v1(20.53,12.44) C27.1 ; C37.1 14.95,4.31 v1(14.3,4.31) U3.11 ; U2.41 16.72,16.49 16.97,16.24 U2.5 19.35,16.24 v1(19.68,16.57) ; U2.41 v1(15.22,16.93) 14.91,17.24 ; U2.41 v1(16.11,16.04) 16.41,15.74 ; U2.41 15.41,16.24 ; U2.41 15.91,16.74 ; C39.1 29.53,26.93 v1(30.14,26.93) 30.92,26.93 ; C41.1 v1(26.54,13.65) ; C8.1 v1(22.23,15.73) ; R3.1 v1(19.47,20.89) ; 16.91,17.74 v1(16.91,20.26) ; 16.91,17.74 U2.8 ; 16.91,17.74 v1(16.87,17.69) 16.41,17.24 ; C14.1 v1(23.43,16.19) ; 13.91,18.24 U2.22 ; 13.91,18.24 14.41,17.74 ; v1(12.06,19.11) 12.44,18.74 U2.21 ; U2.24 14.91,17.24 ; 14.91,17.24 v1(14.46,17.69) 14.41,17.74 ; LED3.1 18.13,2.48 v1(17.14,2.48) ; U4.18 U4.21 32.67,25.93 U4.8 ; U2.26 15.41,16.24 ; 15.41,16.24 v1(15.22,16.04) 14.91,15.74 14.91,13.49 ; 14.41,17.74 U2.18 ; U4.10 v1(31.67,28.51) ; C46.1 v1(24.77,16.7) ; C33.1 v1(15.49,6.24) ; U5.8 30.66,15.1 U5.49 ; 15.91,16.74 v1(16.11,16.93) 16.41,17.24 ; 15.91,16.74 U2.6 ; 17.91,19.49 v1(17.91,20.26) ; 17.58,25.97 17.02,25.97 v1(16.51,26.48) ; 16.41,17.24 U2.14 ; U2.2 17.41,14.74 16.91,15.24 ; C28.1 v1(15.38,10.75) C30.1 v1(16.44,10.75) C29.1 ; U5.49 33.66,18.1 U5.35 ; U5.49 33.66,13.6 U5.23 ; U5.49 29.16,18.1 29.16,19.3 ; U4.6 v1(33.67,28.51) ; U3.8 11.87,5.31 U3.21 U3.18 ; 16.41,15.74 U2.37 ; 16.41,15.74 16.91,15.24 ; v1(13.08,20.13) 13.41,19.8 U2.20 ; C15.2 v1(21.78,18.27) C13.2 ; C2.2 v1(22.1,21.19) ; 16.91,13.49 16.91,15.24 ; U3.6 v1(10.87,2.86) ; LED4.1 v1(17.14,6.85) ; v1(12.87,2.86) U3.10 ; C35.1 v1(28.96,25.04) ; 27.81,22.05 v1(28.41,22.05) 28.96,22.05
  Bottom Layer w0.254: v1(16.91,20.26) 16.89,20.26 ; v1(13.91,20.26) 13.97,20.26 ; v1(23.43,16.19) 23.49,16.19
  vias: v1(0.89,28.07) v1(0.89,27.43) v1(0.89,22.94) v1(0.89,22.31) v1(0.89,18.04) v1(0.89,17.41) v1(0.89,12.94) v1(0.89,12.31) v1(0.89,8.04) v1(0.89,7.41) v1(0.89,2.94) v1(0.89,2.31) v1(1.52,28.07) v1(1.52,27.43) v1(1.52,22.94) v1(1.52,22.31) v1(1.52,18.04) v1(1.52,17.41) v1(1.52,12.94) v1(1.52,12.31) v1(1.52,8.04) v1(1.52,7.41) v1(1.52,2.94) v1(1.52,2.31) v1(2.16,28.07) v1(2.16,27.43) v1(2.16,22.94) v1(2.16,22.31) v1(2.16,18.04) v1(2.16,17.41) v1(2.16,12.94) v1(2.16,12.31) v1(2.16,8.04) v1(2.16,7.41) v1(2.16,2.94) v1(2.16,2.31) v1(2.79,28.07) v1(2.79,27.43) v1(2.79,22.94) v1(2.79,22.31) v1(2.79,18.04) v1(2.79,17.41) v1(2.79,12.94) v1(2.79,12.31) v1(2.79,8.04) v1(2.79,7.41) v1(2.79,2.94) v1(2.79,2.31) v1(3.43,28.07) v1(3.43,27.43) v1(3.43,22.94) v1(3.43,22.31) v1(3.43,18.04) v1(3.43,17.41) v1(3.43,12.94) v1(3.43,12.31) v1(3.43,8.04) v1(3.43,7.41) v1(3.43,2.94) v1(3.43,2.31) v1(4.06,28.07) v1(4.06,27.43) v1(4.06,22.94) v1(4.06,22.31) v1(4.06,18.04) v1(4.06,17.41) v1(4.06,12.94) v1(4.06,12.31) v1(4.06,8.04) v1(4.06,7.41) v1(4.06,2.94) v1(4.06,2.31) v1(4.7,28.07) v1(4.7,27.43) v1(4.7,22.94) v1(4.7,22.31) v1(4.7,18.04) v1(4.7,17.41) v1(4.7,12.94) v1(4.7,12.31) v1(4.7,8.04) v1(4.7,7.41) v1(4.7,2.94) v1(4.7,2.31) v1(11.49,5.69) v1(11.49,4.93) v1(11.94,9.01) v1(11.94,8.26) v1(12.25,5.69) v1(12.25,4.93) v1(14.46,16.93) v1(14.46,16.04) v1(14.46,15.28) v1(15.22,17.69) v1(15.22,15.28) v1(16.11,17.69) v1(16.11,15.28) v1(16.87,16.93) v1(16.87,16.04) v1(16.87,15.28) v1(30.31,17.06) v1(30.31,16.3) v1(30.31,15.41) v1(30.31,14.65) v1(31.07,17.06) v1(31.07,16.3) v1(31.07,15.41) v1(31.07,14.65) v1(31.96,17.06) v1(31.96,16.3) v1(31.96,15.41) v1(31.96,14.65) v1(32.29,26.31) v1(32.29,25.55) v1(32.7,22.86) v1(32.7,22.12) v1(32.72,17.06) v1(32.72,16.3) v1(32.72,15.41) v1(32.72,14.65) v1(33.05,26.31) v1(33.05,25.55) v1(42.55,19.3) v1(42.55,18.67) v1(43.18,19.3) v1(43.18,18.67) v1(47.31,22.1) v1(47.31,21.46) v1(47.43,8.89) v1(47.43,8.26) v1(47.94,22.1) v1(47.94,21.46) v1(48.07,8.89) v1(48.07,8.26) v1(48.58,22.1) v1(48.58,21.46) v1(48.7,8.89) v1(48.7,8.26) v1(49.21,22.1) v1(49.21,21.46) v1(49.34,8.89) v1(49.34,8.26)
CP: length 13.3
  Top Layer w0.254: U2.4 20.97,15.74 C8.2 v1(20.98,16.23) R7.2 ; R5.1 v1(14.39,20.89)
  Inner2 w0.254: v1(20.98,16.23) 20.98,17.82 19.43,19.37 15.92,19.37 v1(14.39,20.89)
CS: length 20.6
  Top Layer w0.254: 29.16,12.4 29.16,11.83 v1(28.7,11.37) ; U2.30 12.02,14.24 v1(11.68,13.91)
  Inner2 w0.254: v1(28.7,11.37) 20.7,11.37 17.91,14.16 11.94,14.16 v1(11.68,13.91)
LD: length 19.4
  Top Layer w0.254: U2.33 14.41,12.95 v1(14.73,12.64) ; U5.16 v1(30.16,11.24)
  Inner2 w0.254: v1(30.16,11.24) 29.81,10.89 29.81,10.57 29.21,9.97 20.19,9.97 17.53,12.64 v1(14.73,12.64)
LD_LED: length 14.5
  Top Layer w0.254: U5.11 27.51,13.6 23.62,9.72 23.62,2.98 23.05,2.41 R8.1
MOSI: length 22.8
  Top Layer w0.254: U5.17 30.66,11.69 30.92,11.44 30.92,11.04 v1(30.48,10.6) ; v1(12.95,12.76) 13.41,13.22 U2.31
  Inner2 w0.254: v1(12.95,12.76) 13.66,12.06 17.09,12.06 19.94,9.21 29.46,9.21 30.48,10.22 v1(30.48,10.6)
OSC_REF: length 1
  Top Layer w0.345: C6.1 R4.2
PA5: length 19.3
  Top Layer w0.254: 29.66,12.4 29.66,11.44 v1(28.96,10.73) ; 13.91,13.49 v1(13.91,12.64)
  Inner2 w0.254: v1(13.91,12.64) 14.68,13.4 17.65,13.4 20.32,10.73 v1(28.96,10.73)
  Bottom Layer w0.254: v1(13.91,12.64) 13.84,12.64
PA13: length 21.5
  Top Layer w0.254: U5.34 v1(35.69,17.6)
  Inner2 w0.254: H1.3 28.32,6.03 29.21,5.14 33.78,5.14 34.8,6.16 34.8,7.68 36.2,9.08 36.2,17.09 v1(35.69,17.6)
PA14: length 29.5
  Top Layer w0.254: U5.37 v1(34.16,20.26)
  Inner2 w0.254: H1.4 28.83,4.13 33.78,4.13 35.43,5.78 35.43,7.3 36.96,8.83 36.96,18.61 35.31,20.26 v1(34.16,20.26)
REF_OUT: length 7.6
  Top Layer w0.345: C4.2 7.69,24.51 6.98,25.21 2.83,25.21 RF2.5
RESET: length 3
  Top Layer w0.254: U5.7 26.14,15.6 R11.1 C46.2
UART1_RX: length 6.6
  Top Layer w0.254: U5.31 36.99,16.1 37.34,16.45 41.25,16.45 CN2.3
UART1_TX: length 7.1
  Top Layer w0.254: CN2.2 38.59,13.93 36.91,15.6 U5.30
VTUNE: length 6
  Top Layer w0.254: U2.23 11.92,17.74 11.14,18.52 C12.2 10.6,19.18 12.36,20.93 12.36,21.42
XREF: length 4
  Top Layer w0.254: 17.44,21.36 R9.1 ; 17.44,21.36 17.44,21.06 17.14,20.76 16.51,20.76 15.91,20.17 15.91,19.49 ; 17.44,21.36 17.5,21.42 18.46,21.42
$1N3433: length 10.7
  Top Layer w0.254: C10.2 C9.1 21.05,14.37 L2.2 v1(20,14.48) 19.24,15.24 U2.3 ; U2.7 v1(19.97,17.24) 20.49,17.76 C13.1
  Bottom Layer w0.254: v1(19.97,17.24) 20.32,16.89 20.32,14.81 v1(20,14.48)
$1N3441: length 1.9
  Top Layer w0.254: 17.91,13.49 17.91,11.59 17.95,11.55
$1N3488: length 2.2
  Top Layer w0.221: U2.29 11.24,14.74 10.96,14.46 C16.1
$1N3500: length 2
  Top Layer w0.254: R5.2 C11.2 R6.1
$1N3537: length 3.4
  Top Layer w0.254: L1.1 21.28,23.61 21.82,23.07 C5.1 23.22,22.25 X1.4
$1N4067: length 2.2
  Top Layer w0.345: X1.3 23.12,24.45 22.56,25 R4.1
$1N4471: length 2.2
  Top Layer w0.221: U2.28 11.24,15.24 11.01,15.47 C17.1
$1N6949: length 13.8
  Top Layer w0.345: RF1.5 2.83,5.14 5.46,5.14 6.6,6.29 6.6,11.26 C16.2
$1N7035: length 7.1
  Top Layer w0.345: C17.2 7.41,15.47 7.11,15.18 RF3.5
$1N7533: length 1.4
  Top Layer w0.254: C37.2 14.95,5.14 14.35,5.14 14.18,5.31 U3.13
$1N7535: length 1.6
  Top Layer w0.254: C38.1 8.57,5.31 U3.3
$1N8207: length 1.5
  Top Layer w0.254: 30.92,25.93 30.27,25.93 30.05,26.15 C39.2
$1N8209: length 1.7
  Top Layer w0.254: 34.42,25.93 36.01,25.93 C40.1
$1N9138: length 4.8
  Top Layer w0.254: R1.1 19.28,23.2 18.46,24.02 ; C6.2 19.05,25 18.67,24.63 18.67,24.23 18.46,24.02 ; R3.2 19.47,23.09 19.56,23.18 ; 18.46,24.02 U1.1
$1N10941: length 0.9
  Top Layer w0.254: R7.1 22.63,16.74
$1N14740: length 4.5
  Top Layer w0.254: v1(18.8,25.97) 19.36,25.97 R2.1
  Top Layer w0.345: 17.58,24.67 v1(16.51,24.67)
  Bottom Layer w0.254: v1(16.51,24.67) 17.81,25.97 v1(18.8,25.97)
$1N14817: length 1.8
  Top Layer w0.345: U1.8 10.88,24.02 10.56,23.71 10.08,23.71
$1N14821: length 6.8
  Top Layer w0.345: C3.1 18.46,22.37 17.78,23.05 16.38,23.05 15.62,23.81 15.62,24.83 16.11,25.32 U1.3
$1N15105: length 1.5
  Top Layer w0.254: R8.2 19.8,2.41 LED3.2
$1N15107: length 1.5
  Top Layer w0.254: R13.2 19.8,6.85 LED4.2
$2N1343: length 2.1
  Top Layer w0.254: C45.2 33.65,10.99 33.16,11.48 U5.22
$2N1390: length 3
  Top Layer w0.254: U5.44 30.66,20.2 29.61,21.25 R12.1
$2N1698: length 1.9
  Top Layer w0.254: U5.9 26.12,14.6 R10.2

## Copper pours and planes (outline as drawn; the poured copper is in the pictures)
+5V on Top Layer: 29.22,25.57 32.31,25.57 32.31,21.84 29.22,21.84
+5V on Top Layer: 12.21,9.34 15.27,9.34 15.27,5.66 12.21,5.66
A3V3 on Top Layer: 9.35,9.33 11.51,9.33 11.51,5.67 9.35,5.67
D3V3 on Top Layer: 33.03,25.57 35.24,25.57 35.24,21.83 33.03,21.83
GND on Top Layer: 11.05,9.33 12.83,9.33 12.83,7.94 11.05,7.94
GND on Top Layer: -0.64,31.05 51.56,31.05 51.56,-0.35 -0.64,-0.35
GND on Top Layer: 31.81,23.18 33.59,23.18 33.59,21.79 31.81,21.79
GND on Bottom Layer: -0.25,30.92 51.43,30.92 51.43,-0.32 -0.25,-0.32
GND on Inner1: -0.51,31.05 51.56,31.05 51.56,-0.44 -0.51,-0.44
GND on Inner2: -0.38,31.05 51.56,31.05 51.56,-0.32 -0.38,-0.32

Small or netless copper shapes (teardrops, artwork), in the pictures only: 367 on Top Layer, 20 on Bottom Layer, 14 on Inner2

## Text on the board
Top Silkscreen Layer: RF_CHA | RF_CHB | LOCKED | PG | REF_OUT | CLK | DIO | GND | 3V3 | +5V | RXD | TXD | 5V | V1.0 | GZC | 25MHz-3GHz Frac PLL
